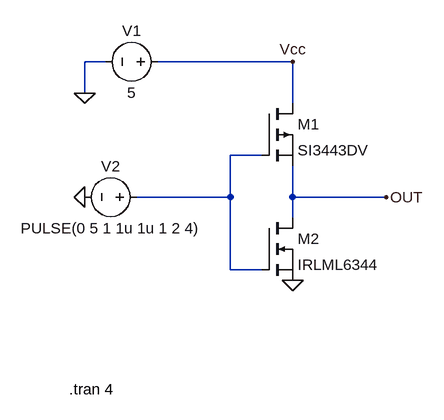
[diagram p0: schematic NOT.asc]
NOT.asc, the LTspice schematic file:
Version 4.1
SHEET 1 880 680
WIRE -128 -16 -160 -16
WIRE 160 -16 -48 -16
WIRE -160 32 -160 -16
WIRE 160 48 160 -16
WIRE 112 128 64 128
WIRE 64 192 64 128
WIRE 64 192 -80 192
WIRE 160 192 160 144
WIRE 304 192 160 192
WIRE 160 224 160 192
WIRE 64 304 64 192
WIRE 112 304 64 304
FLAG -160 32 0
FLAG 160 -16 Vcc
FLAG -160 192 0
FLAG 304 192 OUT
FLAG 160 320 0
SYMBOL voltage -32 -16 R90
WINDOW 0 -32 56 VBottom 2
WINDOW 3 32 56 VTop 2
WINDOW 123 0 0 Left 0
WINDOW 39 0 0 Left 0
SYMATTR InstName V1
SYMATTR Value 5
SYMBOL voltage -64 192 R90
WINDOW 0 -32 56 VBottom 2
WINDOW 3 32 56 VTop 2
WINDOW 123 0 0 Left 0
WINDOW 39 0 0 Left 0
SYMATTR InstName V2
SYMATTR Value PULSE(0 5 1 1u 1u 1 2 4)
SYMBOL pmos 112 48 R0
SYMATTR InstName M1
SYMATTR Value SI3443DV
SYMBOL nmos 112 224 R0
SYMATTR InstName M2
SYMATTR Value IRLML6344
TEXT -184 488 Left 2 !.tran 4

The netlist it stands for:
* NOT.asc
V1 Vcc 0 5
V2 N001 0 PULSE(0 5 1 1u 1u 1 2 4)
M1 Vcc N001 OUT OUT SI3443DV
M2 OUT N001 0 0 IRLML6344
.model NMOS NMOS
.model PMOS PMOS
.lib standard.mos
.tran 4
.backanno
.end